# Altium schematic sheet usb_serial.SchDoc: Fault-Tolerant Quadcopter
size A; DrawnBy: Vaughn Kottler; Engineer: Vaughn Kottler; Revision: A
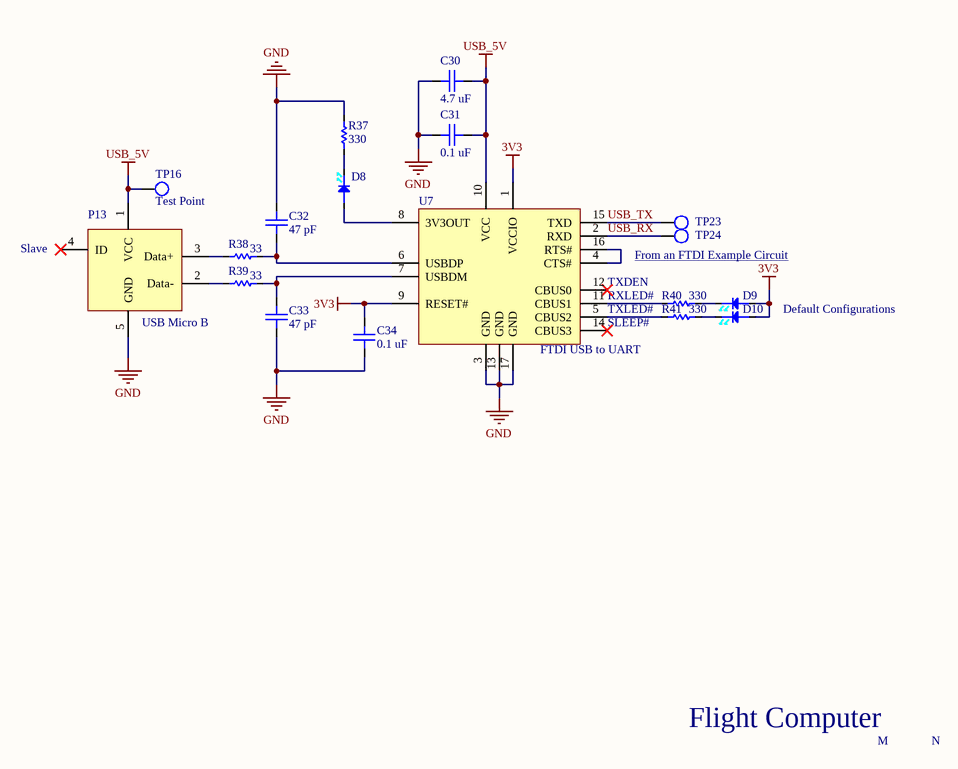
[diagram p0: usb_serial.SchDoc]

## Parts
C30  4.7 uF  [CAP-CER-0805-TALL]
C31  0.1 uF  [CAP-CER-0805-SHORT]
C32  47 pF  [CAP-CER-0805-SHORT]
C33  47 pF  [CAP-CER-0805-SHORT]
C34  0.1 uF  [CAP-CER-0805-SHORT]
D8  LED-WHT-20mA  [LED-0805]  (value not drawn)
D9  LED-WHT-20mA  [LED-0805]  (value not drawn)
D10  LED-WHT-20mA  [LED-0805]  (value not drawn)
P13  USB Micro B  [USB Micro B]
R37  330  [RES-0805]
R38  33  [RES-0805]
R39  33  [RES-0805]
R40  330  [RES-0805]
R41  330  [RES-0805]
TP16  Test Point  [0603 Test Point]
TP23  Test Point  [0603 Test Point]  (value not drawn)
TP24  Test Point  [0603 Test Point]  (value not drawn)
U7  FTDI USB to UART  [QFN16-0.65]

## Nets
3V3: C34.2 D9.1(CT) D10.1(CT) U7.1(VCCIO) U7.9(RESET#)
GND: C30.2 C31.2 C32.2 C33.1 C34.1 P13.5(GND) R37.1 U7.3(GND) U7.13(GND) U7.17(GND)
USB_5V: C30.1 C31.1 P13.1(VCC) TP16.1 U7.10(VCC)
USB_RX: TP24.1 U7.2(RXD)
USB_TX: TP23.1 U7.15(TXD)
NetC32_1: C32.1 R38.2 U7.6(USBDP)
NetC33_2: C33.2 R39.2 U7.7(USBDM)
NetD8_1: D8.1(CT) U7.8(3V3OUT)
NetD8_2: D8.2(AN) R37.2
NetD9_2: D9.2(AN) R40.2
NetD10_2: D10.2(AN) R41.2
NetP13_2: P13.2(Data-) R39.1
NetP13_3: P13.3(Data+) R38.1
NetR40_1: R40.1 U7.11(CBUS1)
NetR41_1: R41.1 U7.5(CBUS2)
NetU7_4: U7.4(CTS#) U7.16(RTS#)

Not connected (* = marked no-connect by the designer): P13 4(ID)*; U7 12(CBUS0)* 14(CBUS3)*

## Notes on the sheet
- (near P13) Slave
- (near TP24) From an FTDI Example Circuit <https://www.ftdichip.com/Support/Documents/AppNotes/AN_216_Using_the_FT230X_to_design_a_GPS_Dongle.pdf>
- TXDEN
- RXLED#
- TXLED#
- SLEEP#
- Default Configurations
- Flight Computer
- M
- N

## Library data of the parts
C30 = CAP-CER-4.7uF-10V: ±10%, 0805; ComponentLink1Description: Capacitor Book (Amazon); ComponentLink1URL: https://www.amazon.com/gp/product/B0728HBDRW/
C31 C34 = CAP-CER-0.1uF-25V: ±10%, 0805; ComponentLink1Description: Capacitor Book (Amazon); ComponentLink1URL: https://www.amazon.com/gp/product/B0728HBDRW/
C32 C33 = CAP-CER-47pF-50V: ±5%, 0805; ComponentLink1Description: Capacitor Book (Amazon); ComponentLink1URL: https://www.amazon.com/gp/product/B0728HBDRW/
D8-D10 = LED-WHT-20mA: 2.2V, 0805; ComponentLink1Description: Resistor Book (Amazon); ComponentLink1URL: https://www.amazon.com/gp/product/B071J21FYF/; Supplier 1: Digi-Key; Supplier Part Number 1: 475-1410-1-ND
R37 R40 R41 = RES-330-1/8W: 0805; ComponentLink1Description: Resistor Book (Amazon); ComponentLink1URL: https://www.amazon.com/gp/product/B071J21FYF/
R38 R39 = RES-33-1/8W: 0805; ComponentLink1Description: Resistor Book (Amazon); ComponentLink1URL: https://www.amazon.com/gp/product/B071J21FYF/
TP16 TP23 TP24 = Test Point: 0603; Supplier 1: Digi-Key; Supplier Part Number 1: A106145DKR-ND
U7 = FT230XQ-R: Supplier 1: Digi-Key; Supplier Part Number 1: 768-1130-6-ND; ComponentLink1Description: Datasheet; ComponentLink1URL: https://www.ftdichip.com/Support/Documents/DataSheets/ICs/DS_FT230X.pdf
P13 = USB Micro B: Supplier 1: Digi-Key; Supplier Part Number 1: 609-4616-6-ND; ComponentLink1Description: Pinout; ComponentLink1URL: http://pinouts.ru/PortableDevices/micro_usb_pinout.shtml